# Altium schematic sheet Hydrophone.SchDoc
size A4
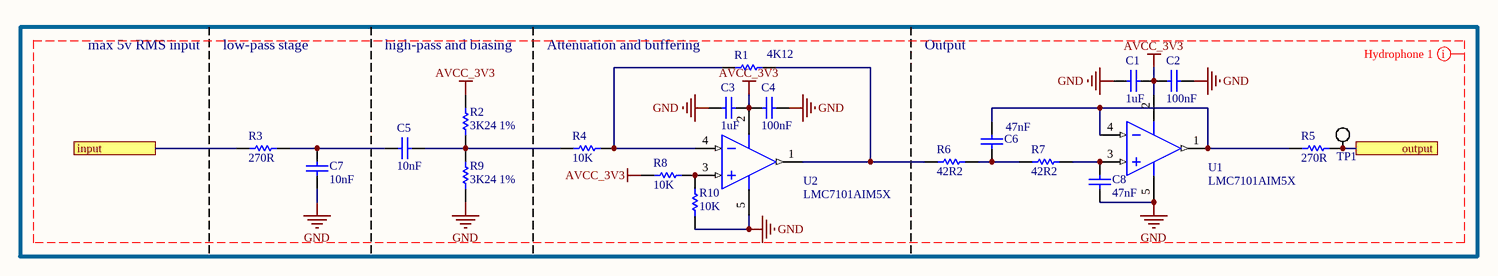
[diagram p0: Hydrophone.SchDoc]

## Parts
C1  1uF  [CAPC0603(1608)100_N]
C2  100nF  [CAPC0603(1608)100_N]
C3  1uF  [CAPC0603(1608)100_N]
C4  100nF  [CAPC0603(1608)100_N]
C5  10nF  [CAPC0603(1608)100_N]
C6  47nF  [CAPC0603(1608)100_N]
C7  10nF  [CAPC0603(1608)100_N]
C8  47nF  [CAPC0603(1608)100_N]
R1  4K12  [RESC0603(1608)_N]
R2  3K24 1%  [RESC0603(1608)_N]
R3  270R  [RESC0603(1608)_N]
R4  10K  [RESC0603(1608)_N]
R5  270R  [RESC0603(1608)_N]
R6  42R2  [RESC0603(1608)_N]
R7  42R2  [RESC0603(1608)_N]
R8  10K  [RESC0603(1608)_N]
R9  3K24 1%  [RESC0603(1608)_N]
R10  10K  [RESC0603(1608)_N]
TP1  Test Point Loop  [Test Point Loop - Black]  (value not drawn)
U1  LMC7101AIM5X  [DBV0005A_N]
U2  LMC7101AIM5X  [DBV0005A_N]

## Ports
input, output

## Nets
AVCC_3V3: C1.1 C2.2 C3.1 C4.2 R2.2 R8.1 U1.2(V+) U2.2(V+)
GND: C1.2 C2.1 C3.2 C4.1 C7.1 C8.1 R9.1 R10.1 U1.5(V-) U2.5(V-)
input: R3.1 ; port input
output: R5.2 TP1.1 ; port output
NetC5_1: C5.1 C7.2 R3.2
NetC5_2: C5.2 R2.1 R4.1 R9.2
NetC6_1: C6.1 R6.2 R7.1
NetC6_2: C6.2 R5.1 U1.1(OUT) U1.4(IN-)
NetC8_2: C8.2 R7.2 U1.3(IN+)
NetR1_1: R1.1 R4.2 U2.4(IN-)
NetR1_2: R1.2 R6.1 U2.1(OUT)
NetR8_2: R8.2 R10.2 U2.3(IN+)

## Layout directives
net class Hydrophone1: AVCC_3V3, GND

## Notes on the sheet
- max 5v RMS input
- low-pass stage
- high-pass and biasing
- (near R1) Attenuation and buffering
- Output

## Library data of the parts
C1 = CMP-1035-02733-1: CAP 1uF 10V ±10% 0603 (1608 Metric) Thickness 1mm SMD; Tolerance: Â±10%; Case-EIA: 0603; Case-Metric: 1608; Rated Voltage: 10 V; Max Thickness: 1 mm; Value: 1uF; Technology: SMT
C2 = CMP-1035-02580-1: CAP 100nF 10V ±10% 0603 (1608 Metric) Thickness 1mm SMD; Tolerance: Â±10%; Case-EIA: 0603; Case-Metric: 1608; Max Thickness: 1 mm; Value: 100nF; Rated Voltage: 10 V; Technology: SMT
C3 = CMP-1035-02733-1: CAP 1uF 10V ±10% 0603 (1608 Metric) Thickness 1mm SMD; Tolerance: Â±10%; Case-EIA: 0603; Case-Metric: 1608; ChannelOffset: 8; Rated Voltage: 10 V; Max Thickness: 1 mm; Value: 1uF; Technology: SMT
C4 = CMP-1035-02580-1: CAP 100nF 10V ±10% 0603 (1608 Metric) Thickness 1mm SMD; Tolerance: Â±10%; Case-EIA: 0603; Case-Metric: 1608; ChannelOffset: 9; Max Thickness: 1 mm; Value: 100nF; Rated Voltage: 10 V; Technology: SMT
C5 = CMP-1035-02314-1: CAP 10nF 25V ±1% 0603 (1608 Metric) Thickness 1mm SMD; Case-EIA: 0603; Tolerance: Â±1%; Case-Metric: 1608; ChannelOffset: 3; Technology: SMT; Value: 10nF; Rated Voltage: 25 V; Max Thickness: 1 mm
C6 C8 = CMP-1035-02506-1: CAP 47nF 25V ±5% 0603 (1608 Metric) Thickness 1mm SMD; Tolerance: Â±5%; Case-Metric: 1608; Case-EIA: 0603; Max Thickness: 1 mm; Rated Voltage: 25 V; Value: 47nF; Technology: SMT
C7 = CMP-1035-02314-1: CAP 10nF 25V ±1% 0603 (1608 Metric) Thickness 1mm SMD; Case-EIA: 0603; Tolerance: Â±1%; Case-Metric: 1608; ChannelOffset: 2; Technology: SMT; Value: 10nF; Rated Voltage: 25 V; Max Thickness: 1 mm
R1 = CMP-1012-00579-1: 4K12 0.1W 1% 0603 (1608 Metric)  SMD; Case-EIA: 0603; Value: 4120.00 Ohm; Case-Metric: 1608; Technology: SMT; Tolerance: 1 %; Power: 0.1 W; Parameter 1: *
R2 = CMP-1012-00566-1: 3K24 0.1W 1% 0603 (1608 Metric)  SMD; Value: 3240.00 Ohm; Case-Metric: 1608; Case-EIA: 0603; ChannelOffset: 3; Tolerance: 1 %; Technology: SMT; Power: 0.1 W
R3 = CMP-1012-00444-1: 270R 0.1W 1% 0603 (1608 Metric)  SMD; Value: 270.00 Ohm; Case-EIA: 0603; Case-Metric: 1608; ChannelOffset: 1; Technology: SMT; Power: 0.1 W; Tolerance: 1 %
R4 = CMP-1012-00623-1: 10K 0.1W 1% 0603 (1608 Metric)  SMD; Value: 10000.00 Ohm; Case-EIA: 0603; Case-Metric: 1608; ChannelOffset: 5; Power: 0.1 W; Tolerance: 1 %; Technology: SMT
R5 = CMP-1012-00444-1: 270R 0.1W 1% 0603 (1608 Metric)  SMD; Value: 270.00 Ohm; Case-EIA: 0603; Case-Metric: 1608; Technology: SMT; Power: 0.1 W; Tolerance: 1 %
R6 R7 = CMP-1012-00354-1: 42R2 0.1W 1% 0603 (1608 Metric)  SMD; Case-Metric: 1608; Case-EIA: 0603; Value: 42.20 Ohm; Tolerance: 1 %; Power: 0.1 W; Technology: SMT
R8 R10 = CMP-1012-00623-1: 10K 0.1W 1% 0603 (1608 Metric)  SMD; Value: 10000.00 Ohm; Case-EIA: 0603; Case-Metric: 1608; ChannelOffset: 6; Power: 0.1 W; Tolerance: 1 %; Technology: SMT
R9 = CMP-1012-00566-1: 3K24 0.1W 1% 0603 (1608 Metric)  SMD; Value: 3240.00 Ohm; Case-Metric: 1608; Case-EIA: 0603; ChannelOffset: 4; Tolerance: 1 %; Technology: SMT; Power: 0.1 W
TP1 = Test Point Loop: Keyston Electronics 5001 Test Point Loop; Manufacturer P/N: 5001; Manufacturer: Keystone Electronics; Color: Black; Supplier 1: Digi-Key; Supplier Part Number 1: 36-5001-ND
U1 = CMP-0055-01331-3: Tiny Low Power Operational Amplifier with Rail-to-Rail Input and Output, 5-pin SOT-23; Manufacturer: Texas Instruments; CompType: Amplifiers; PowerWise: N; PackageTopMarking: A00A*XTT; Package Reference: DBV0005A; ComponentLink1URL: http://www.ti.com/general/docs/lit/getliterature.tsp?genericPartNumber=LMC7101&fileType=pdf; ComponentLink1Description: Datasheet URL; RoHS: N; PackageDescription: Molded SOT-23, .115 x .063 x .040 in Body, 5 Lead, .0375 in Pitch; PinCount: 5
U2 = CMP-0055-01331-3: Tiny Low Power Operational Amplifier with Rail-to-Rail Input and Output, 5-pin SOT-23; Manufacturer: Texas Instruments; CompType: Amplifiers; PowerWise: N; PackageTopMarking: A00A*XTT; ChannelOffset: 7; Package Reference: DBV0005A; ComponentLink1URL: http://www.ti.com/general/docs/lit/getliterature.tsp?genericPartNumber=LMC7101&fileType=pdf; ComponentLink1Description: Datasheet URL; RoHS: N; PackageDescription: Molded SOT-23, .115 x .063 x .040 in Body, 5 Lead, .0375 in Pitch; PinCount: 5